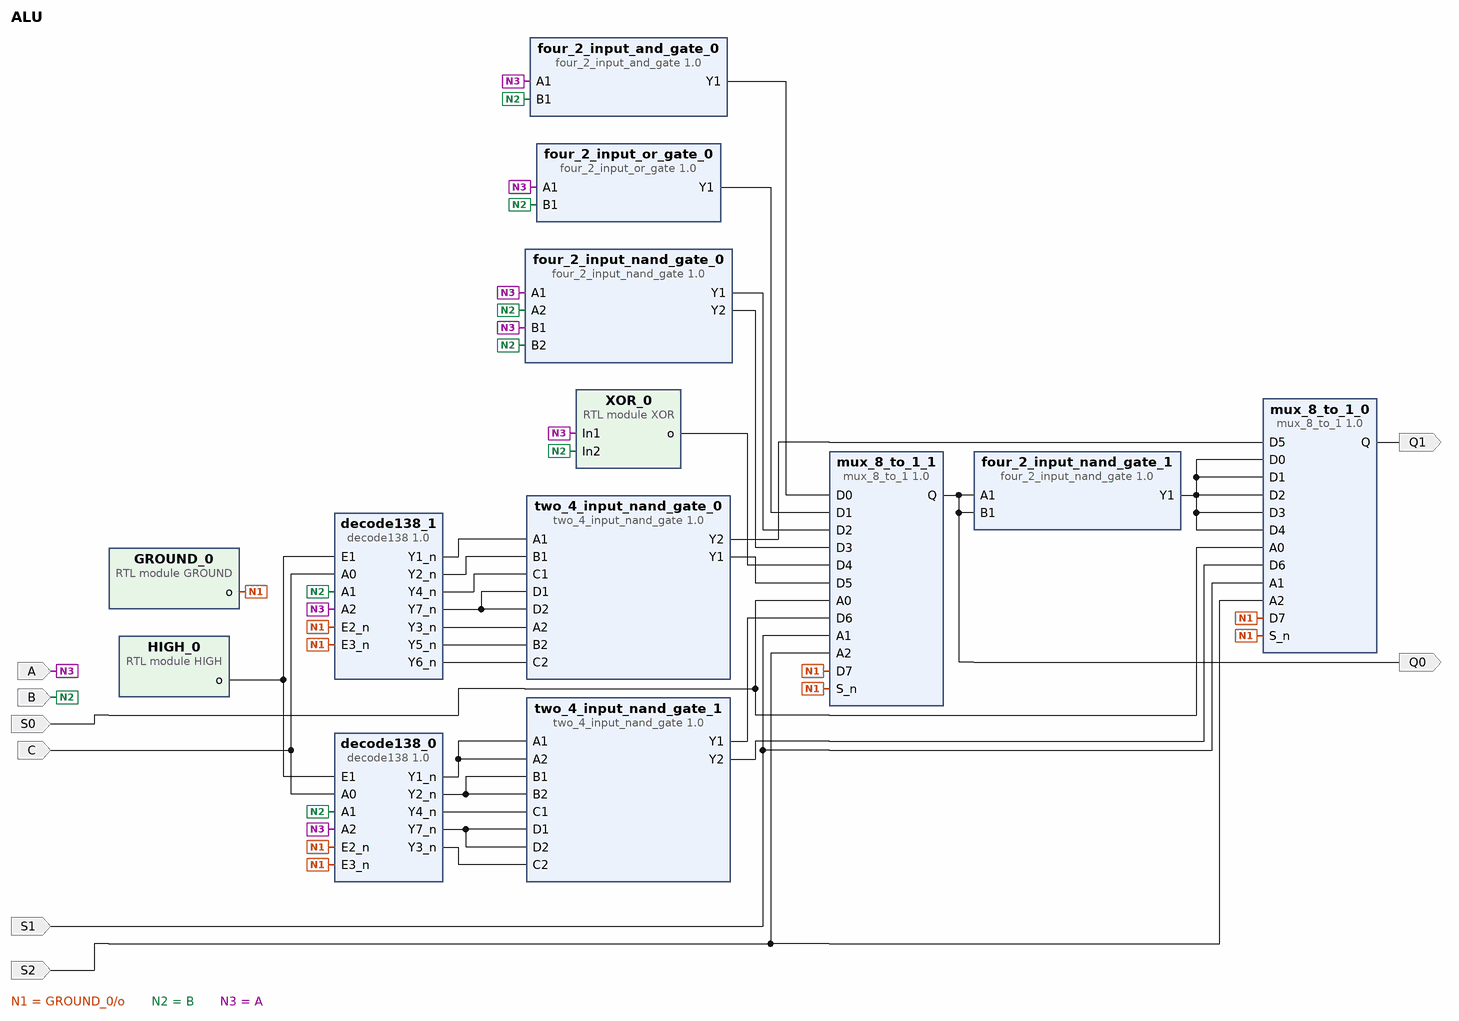
[diagram p0: block diagram of the top level]
# Vivado block design ALU, xc7a35tcpg236-1, Vivado 2017.2
create_bd_design ALU

create_bd_port -dir I A
create_bd_port -dir I C
create_bd_port -dir I S0
create_bd_port -dir I S1
create_bd_port -dir I S2
create_bd_port -dir I B
create_bd_port -dir O Q0
create_bd_port -dir O Q1

create_bd_cell -type ip -vlnv xilinx.com:xup:mux_8_to_1:1.0 mux_8_to_1_0
create_bd_cell -type ip -vlnv xilinx.com:xup:mux_8_to_1:1.0 mux_8_to_1_1
create_bd_cell -type ip -vlnv xilinx.com:XUP:decode138:1.0 decode138_0
create_bd_cell -type ip -vlnv xilinx.com:XUP:decode138:1.0 decode138_1
create_bd_cell -type ip -vlnv xilinx.com:XUP:two_4_input_nand_gate:1.0 two_4_input_nand_gate_0
create_bd_cell -type ip -vlnv xilinx.com:XUP:two_4_input_nand_gate:1.0 two_4_input_nand_gate_1
create_bd_cell -type ip -vlnv xilinx.com:XUP:four_2_input_nand_gate:1.0 four_2_input_nand_gate_0
create_bd_cell -type ip -vlnv xilinx.com:XUP:four_2_input_and_gate:1.0 four_2_input_and_gate_0
create_bd_cell -type ip -vlnv xilinx.com:XUP:four_2_input_or_gate:1.0 four_2_input_or_gate_0
create_bd_cell -type module -reference GROUND GROUND_0
create_bd_cell -type module -reference HIGH HIGH_0
create_bd_cell -type module -reference XOR XOR_0
create_bd_cell -type ip -vlnv xilinx.com:XUP:four_2_input_nand_gate:1.0 four_2_input_nand_gate_1

# ---- connections ----

connect_bd_net [get_bd_pins decode138_1/Y1_n] [get_bd_pins two_4_input_nand_gate_0/A1]
connect_bd_net [get_bd_pins decode138_1/Y2_n] [get_bd_pins two_4_input_nand_gate_0/B1]
connect_bd_net [get_bd_pins decode138_1/Y4_n] [get_bd_pins two_4_input_nand_gate_0/C1]
connect_bd_net [get_bd_pins decode138_1/Y7_n] [get_bd_pins two_4_input_nand_gate_0/D1] [get_bd_pins two_4_input_nand_gate_0/D2]
connect_bd_net [get_bd_pins decode138_1/Y3_n] [get_bd_pins two_4_input_nand_gate_0/A2]
connect_bd_net [get_bd_pins decode138_1/Y5_n] [get_bd_pins two_4_input_nand_gate_0/B2]
connect_bd_net [get_bd_pins decode138_1/Y6_n] [get_bd_pins two_4_input_nand_gate_0/C2]
connect_bd_net [get_bd_pins decode138_0/Y1_n] [get_bd_pins two_4_input_nand_gate_1/A1] [get_bd_pins two_4_input_nand_gate_1/A2]
connect_bd_net [get_bd_pins decode138_0/Y2_n] [get_bd_pins two_4_input_nand_gate_1/B1] [get_bd_pins two_4_input_nand_gate_1/B2]
connect_bd_net [get_bd_pins decode138_0/Y4_n] [get_bd_pins two_4_input_nand_gate_1/C1]
connect_bd_net [get_bd_pins decode138_0/Y7_n] [get_bd_pins two_4_input_nand_gate_1/D1] [get_bd_pins two_4_input_nand_gate_1/D2]
connect_bd_net [get_bd_pins decode138_0/Y3_n] [get_bd_pins two_4_input_nand_gate_1/C2]
connect_bd_net [get_bd_pins two_4_input_nand_gate_0/Y1] [get_bd_pins mux_8_to_1_1/D5]
connect_bd_net [get_bd_pins two_4_input_nand_gate_0/Y2] [get_bd_pins mux_8_to_1_0/D5]
connect_bd_net [get_bd_pins two_4_input_nand_gate_1/Y1] [get_bd_pins mux_8_to_1_1/D6]
connect_bd_net [get_bd_pins two_4_input_nand_gate_1/Y2] [get_bd_pins mux_8_to_1_0/D6]
connect_bd_net [get_bd_pins HIGH_0/o] [get_bd_pins decode138_0/E1] [get_bd_pins decode138_1/E1]
connect_bd_net [get_bd_pins GROUND_0/o] \
  [get_bd_pins decode138_0/E2_n] [get_bd_pins decode138_0/E3_n] [get_bd_pins decode138_1/E2_n] [get_bd_pins decode138_1/E3_n] \
  [get_bd_pins mux_8_to_1_1/S_n] [get_bd_pins mux_8_to_1_0/S_n] [get_bd_pins mux_8_to_1_1/D7] [get_bd_pins mux_8_to_1_0/D7]
connect_bd_net [get_bd_ports S0] [get_bd_pins mux_8_to_1_1/A0] [get_bd_pins mux_8_to_1_0/A0]
connect_bd_net [get_bd_ports S1] [get_bd_pins mux_8_to_1_1/A1] [get_bd_pins mux_8_to_1_0/A1]
connect_bd_net [get_bd_ports S2] [get_bd_pins mux_8_to_1_1/A2] [get_bd_pins mux_8_to_1_0/A2]
connect_bd_net [get_bd_pins four_2_input_and_gate_0/Y1] [get_bd_pins mux_8_to_1_1/D0]
connect_bd_net [get_bd_pins four_2_input_or_gate_0/Y1] [get_bd_pins mux_8_to_1_1/D1]
connect_bd_net [get_bd_pins four_2_input_nand_gate_0/Y1] [get_bd_pins mux_8_to_1_1/D2]
connect_bd_net [get_bd_pins four_2_input_nand_gate_0/Y2] [get_bd_pins mux_8_to_1_1/D3]
connect_bd_net [get_bd_pins XOR_0/o] [get_bd_pins mux_8_to_1_1/D4]
connect_bd_net -net Q0 [get_bd_pins mux_8_to_1_1/Q] \
  [get_bd_ports Q0] [get_bd_pins four_2_input_nand_gate_1/A1] [get_bd_pins four_2_input_nand_gate_1/B1]
connect_bd_net -net Q1 [get_bd_pins mux_8_to_1_0/Q] [get_bd_ports Q1]
connect_bd_net [get_bd_ports C] [get_bd_pins decode138_0/A0] [get_bd_pins decode138_1/A0]
connect_bd_net [get_bd_ports B] \
  [get_bd_pins decode138_0/A1] [get_bd_pins decode138_1/A1] [get_bd_pins four_2_input_nand_gate_0/A2] \
  [get_bd_pins four_2_input_nand_gate_0/B2] [get_bd_pins four_2_input_and_gate_0/B1] [get_bd_pins four_2_input_or_gate_0/B1] \
  [get_bd_pins XOR_0/In2]
connect_bd_net [get_bd_ports A] \
  [get_bd_pins decode138_0/A2] [get_bd_pins decode138_1/A2] [get_bd_pins four_2_input_nand_gate_0/A1] \
  [get_bd_pins four_2_input_nand_gate_0/B1] [get_bd_pins four_2_input_and_gate_0/A1] [get_bd_pins four_2_input_or_gate_0/A1] \
  [get_bd_pins XOR_0/In1]
connect_bd_net [get_bd_pins four_2_input_nand_gate_1/Y1] \
  [get_bd_pins mux_8_to_1_0/D0] [get_bd_pins mux_8_to_1_0/D1] [get_bd_pins mux_8_to_1_0/D2] [get_bd_pins mux_8_to_1_0/D3] \
  [get_bd_pins mux_8_to_1_0/D4]

validate_bd_design
save_bd_design
